# EAGLE board GBARPi (EAGLE 9.6.2)
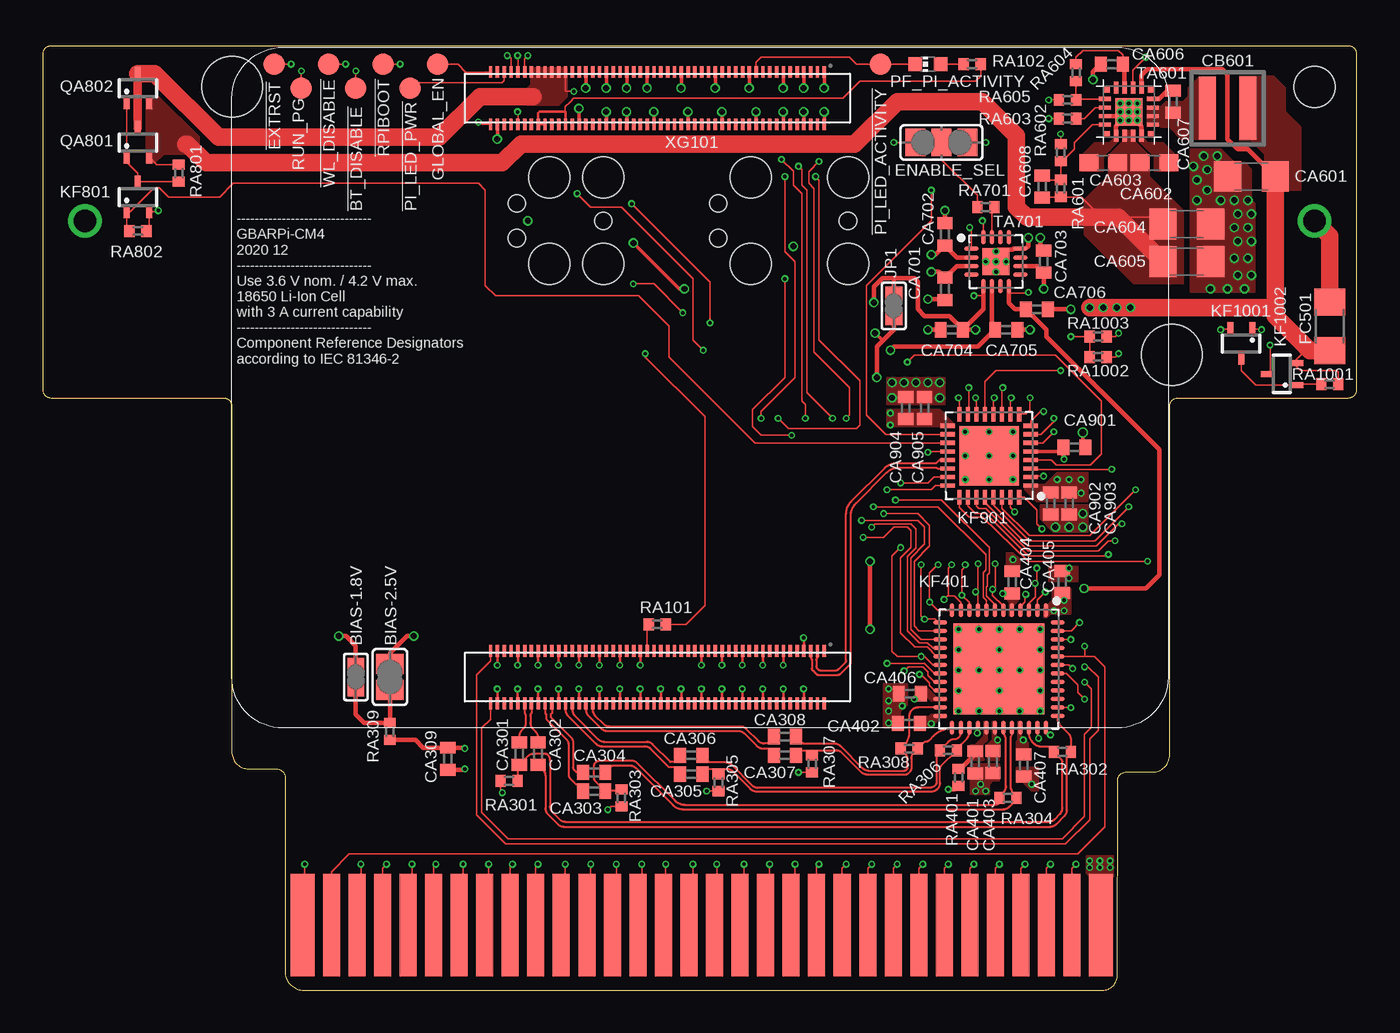
[diagram p3: board, top side]
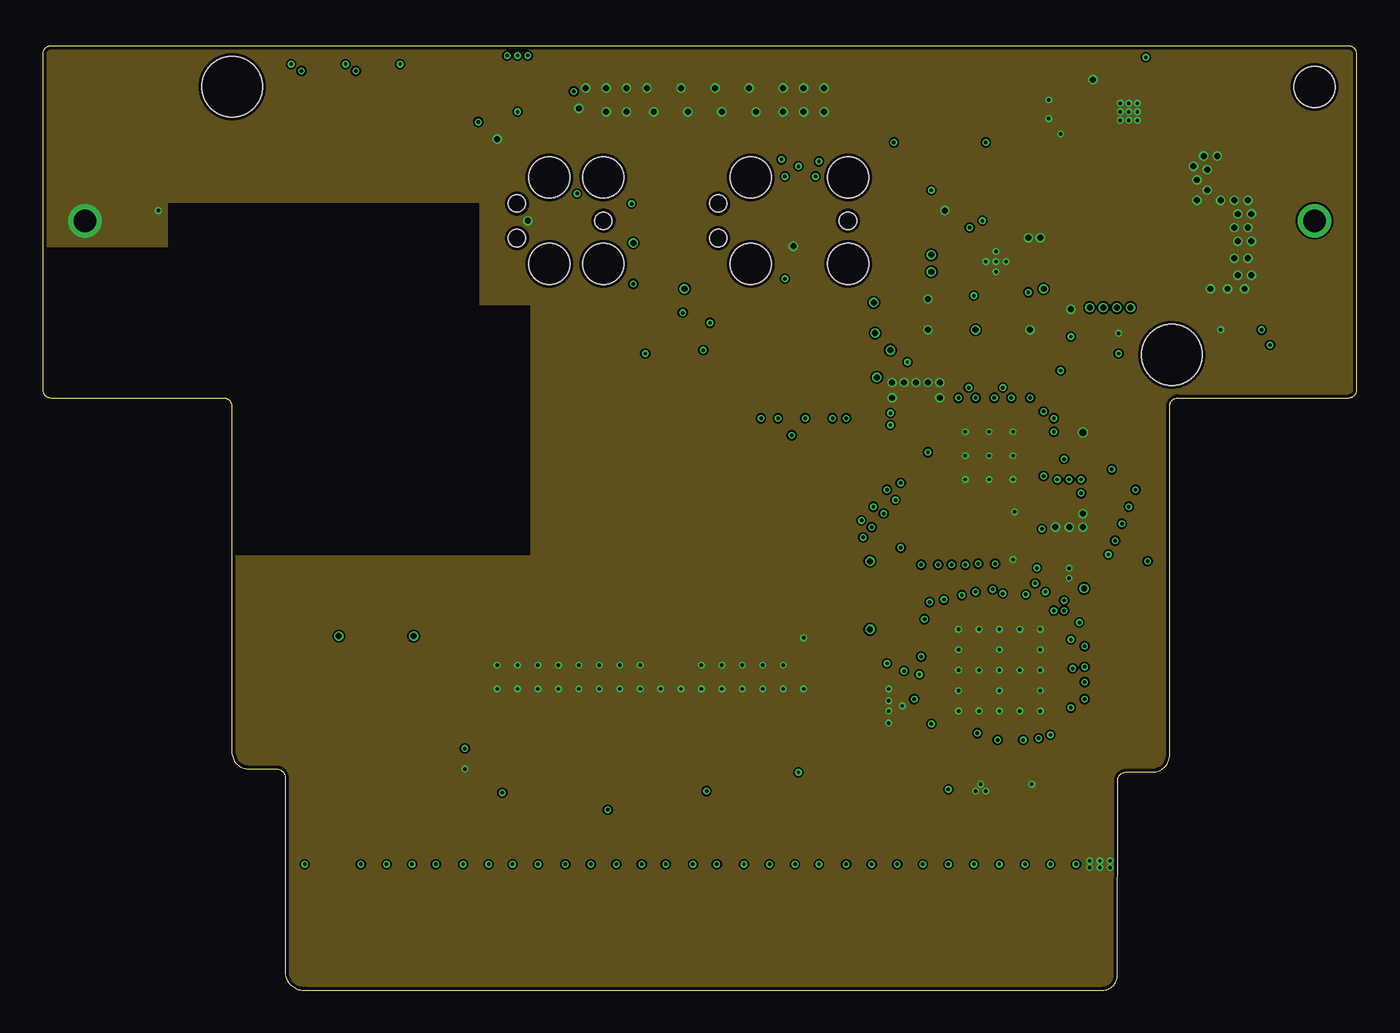
[diagram p4: board, inner layer GND]
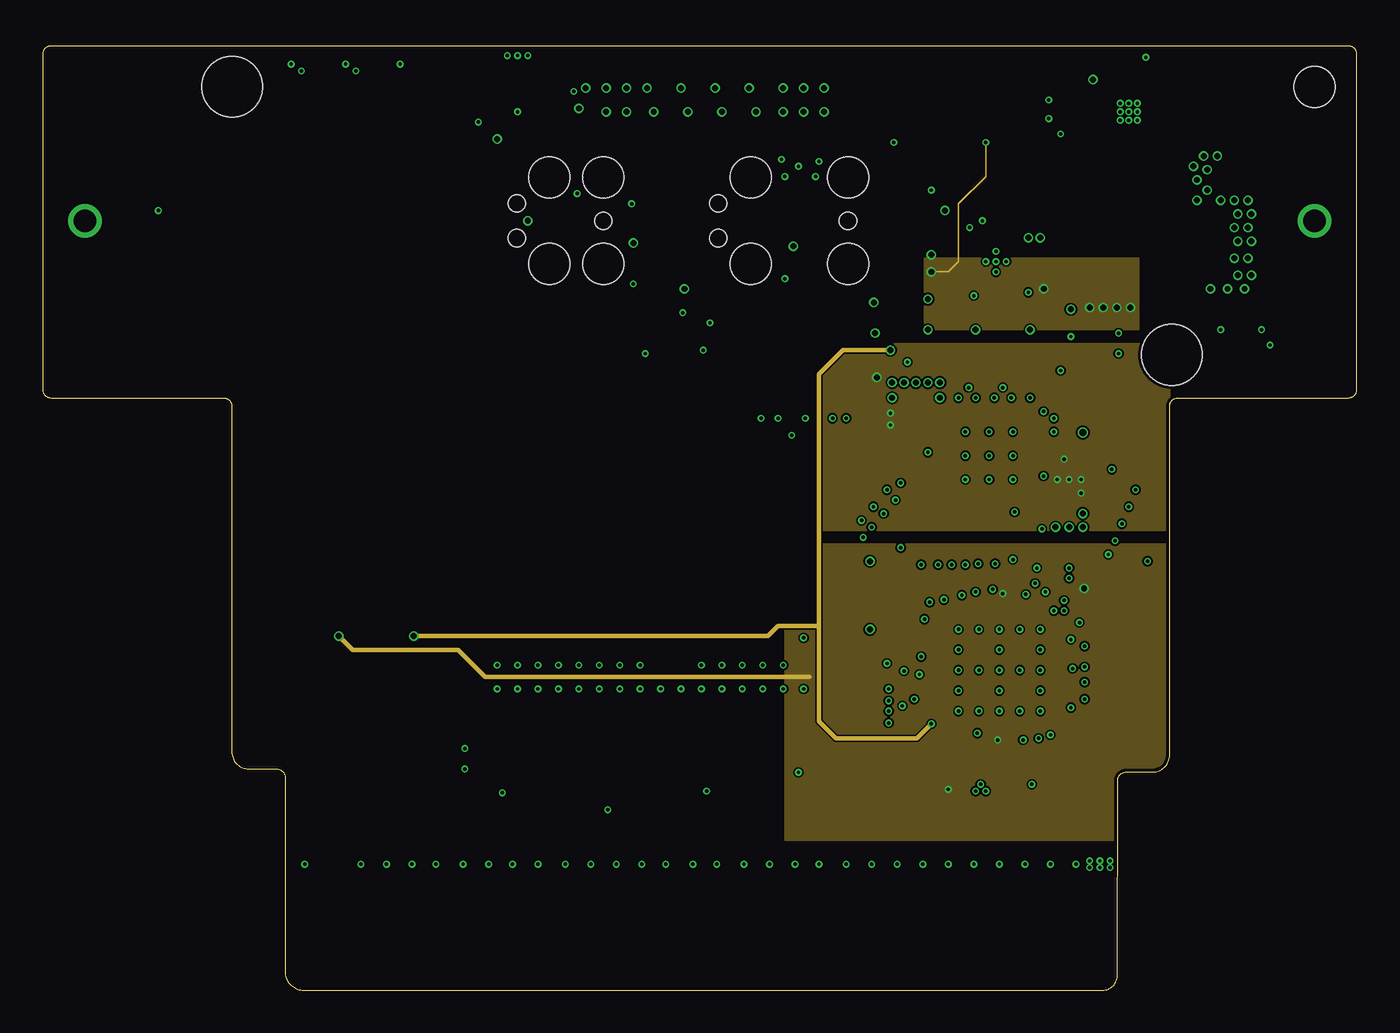
[diagram p5: board, inner layer Route15]
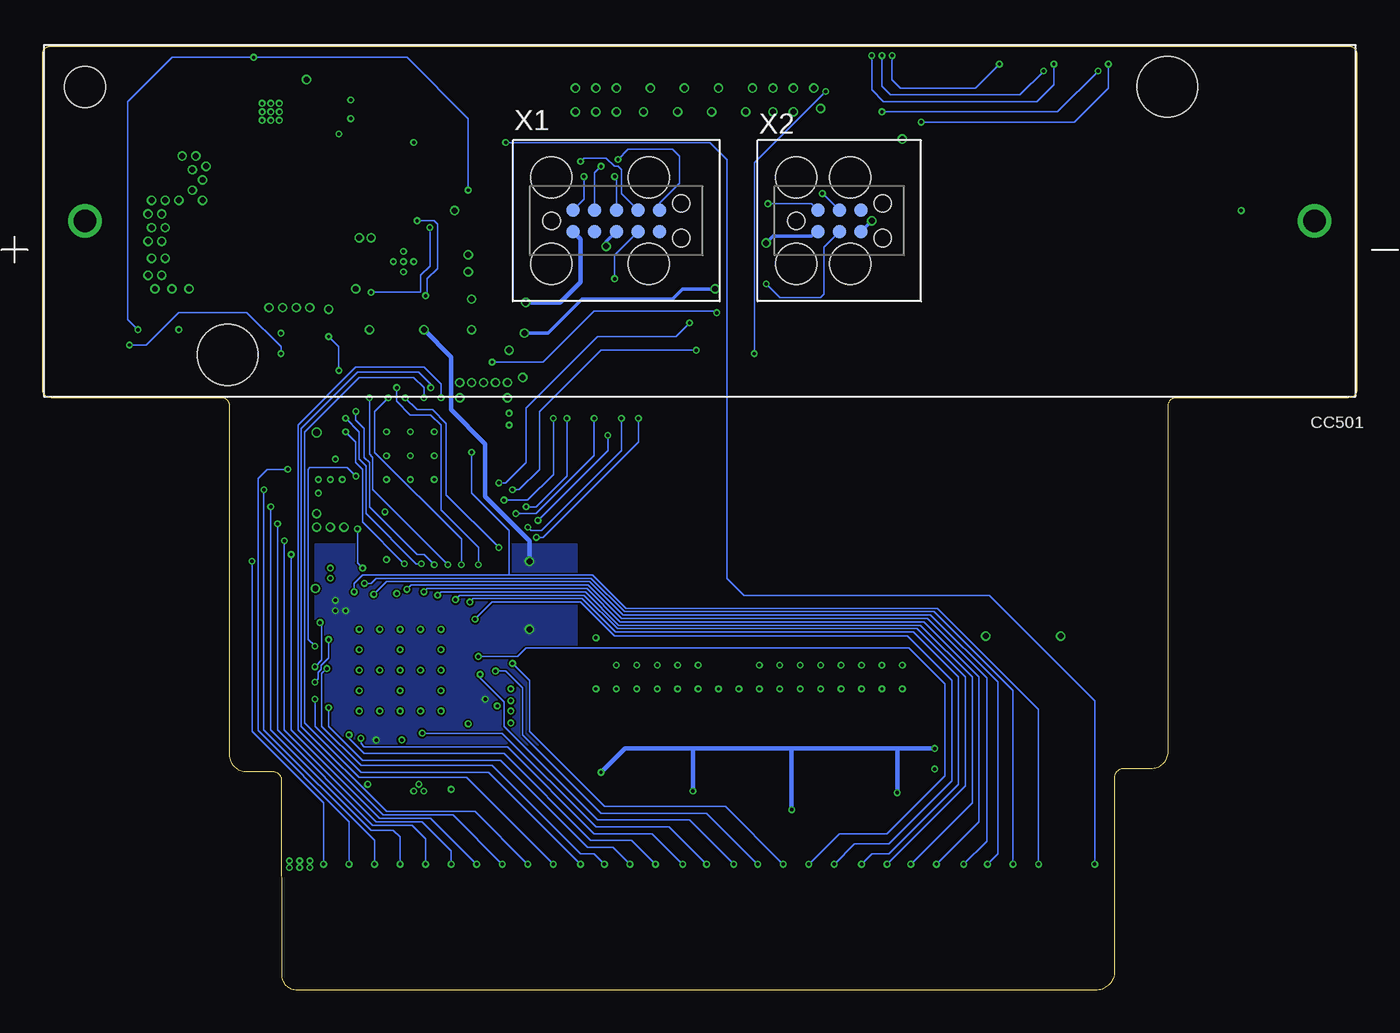
[diagram p6: board, bottom side, seen from below]

Size 77.2 x 55.47 mm. Coordinates in mm from the lower left corner, seen from the top.
Outline: 63.13,1 63.14,12.32 arc-90 63.64,12.82 65.2,12.82 arc90 66.2,13.82 66.2,34.3 arc-90 66.7,34.8 76.7,34.8 arc90 77.2,35.3 77.2,54.97 arc90 76.7,55.47 0.5,55.47 arc90 0,54.97 0,35.3 arc90 0.5,34.8 10.62,34.8 arc-90 11.12,34.3 11.12,14.01 arc90 12.12,13.01 13.75,13.01 arc-90 14.25,12.51 14.25,1 arc90 15.45,0 62.33,0 arc90 63.13,1
Copper layers (1+2*15+16): Top 0.018mm / dielectric 0.36mm / GND 0.035mm / dielectric 0.71mm / Route15 0.035mm / dielectric 0.36mm / Bottom 0.018mm
Design rules "Multi-CB_4L_100um-Tracks_OL35um-IL35um *": minimum track width 0.1mm, minimum drill 0.2mm, track to track 0.1mm, track to pad 0.1mm, pad to pad 0.1mm, via to via 0.1mm, smd to smd 0mil, copper to edge 0.2mm, drill to drill 0.2mm, minimum pad ring 0.125mm, minimum via ring 0.1mm, stop-mask expansion 2mil, vias tented up to drill 0.45mm, thermal gap 0.2mm
Net classes: 1 HDMI: width 0.12 mm, clearance 0.15 mm; 2 USB: width 0.12 mm, clearance 0.15 mm

## Footprints (pad centres in the part's own frame; a part is rotated, then mirrored left to right if it is on the bottom)
B1,27 = smd 1.27 x 1.27: TP 0,0
SJS-NC3 = smd 0.991 x 0.991: 1 -0.635,0; 2 0.635,0
SJ = smd 1.168 x 1.6: 1 -0.762,0; 2 0.762,0
C0402 = smd 0.7 x 0.9: 1 -0.65,0; 2 0.65,0
C1206 = smd 1.6 x 1.8: 1 -1.4,0; 2 1.4,0
C0603 = smd 1.1 x 1: 1 -0.85,0; 2 0.85,0
WE-MAPI_4020 = smd 0.98 x 3.7: 1 -1.185,0; 2 1.185,0
BAT_1043 = drill 1.32: N -36.11,0; P 36.11,0 | hole 3.55: 27.73,7.87; -27.47,-7.87 | hole 2.39: 36.11,-7.87
SJ_2 = smd 1.168 x 1.6: 1 -1.524,0; 2 0,0; 3 1.524,0
R1206 = smd 1.6 x 1.803: 1 -1.422,0; 2 1.422,0
QFN50P700X700X100-49T535N = smd 0.811 x 0.257: 1 -3.451,2.75; 2 -3.451,2.25; 3 -3.451,1.75; 4 -3.451,1.25; 5 -3.451,0.75; 6 -3.451,0.25; 7 -3.451,-0.25; 8 -3.451,-0.75; 9 -3.451,-1.25; 10 -3.451,-1.75; 11 -3.451,-2.25; 12 -3.451,-2.75; 25 3.451,-2.75; 26 3.451,-2.25; 27 3.451,-1.75; 28 3.451,-1.25; 29 3.451,-0.75; 30 3.451,-0.25; 31 3.451,0.25; 32 3.451,0.75; 33 3.451,1.25; 34 3.451,1.75; 35 3.451,2.25; 36 3.451,2.75 | smd 0.257 x 0.811: 13 -2.75,-3.451; 14 -2.25,-3.451; 15 -1.75,-3.451; 16 -1.25,-3.451; 17 -0.75,-3.451; 18 -0.25,-3.451; 19 0.25,-3.451; 20 0.75,-3.451; 21 1.25,-3.451; 22 1.75,-3.451; 23 2.25,-3.451; 24 2.75,-3.451; 37 2.75,3.451; 38 2.25,3.451; 39 1.75,3.451; 40 1.25,3.451; 41 0.75,3.451; 42 0.25,3.451; 43 -0.25,3.451; 44 -0.75,3.451; 45 -1.25,3.451; 46 -1.75,3.451; 47 -2.25,3.451; 48 -2.75,3.451 | smd 5.35 x 5.35: EXP 0,0
SC70-3 = smd 0.35 x 0.8: 1 -0.65,-0.85; 2 0.65,-0.85; 3 0,0.85
QFN50P500X500X60-33T350N = smd 0.862 x 0.254: 1 -2.435,1.75; 2 -2.435,1.25; 3 -2.435,0.75; 4 -2.435,0.25; 5 -2.435,-0.25; 6 -2.435,-0.75; 7 -2.435,-1.25; 8 -2.435,-1.75; 17 2.435,-1.75; 18 2.435,-1.25; 19 2.435,-0.75; 20 2.435,-0.25; 21 2.435,0.25; 22 2.435,0.75; 23 2.435,1.25; 24 2.435,1.75 | smd 0.254 x 0.862: 9 -1.75,-2.435; 10 -1.25,-2.435; 11 -0.75,-2.435; 12 -0.25,-2.435; 13 0.25,-2.435; 14 0.75,-2.435; 15 1.25,-2.435; 16 1.75,-2.435; 25 1.75,2.435; 26 1.25,2.435; 27 0.75,2.435; 28 0.25,2.435; 29 -0.25,2.435; 30 -0.75,2.435; 31 -1.25,2.435; 32 -1.75,2.435 | smd 3.5 x 3.5: 33 0,0
CHIP-LED0603 = smd 0.8 x 0.8: A 0,-0.75; C 0,0.75
R0402 = smd 0.6 x 0.7: 1 -0.5,0; 2 0.5,0
LQFN16 = smd 0.7 x 0.25: 1 -1.405,0.75; 2 -1.405,0.25; 3 -1.405,-0.25; 4 -1.405,-0.75; 9 1.405,-0.75; 10 1.405,-0.25; 11 1.405,0.25; 12 1.405,0.75 | smd 0.25 x 0.7: 5 -0.75,-1.405; 6 -0.25,-1.405; 7 0.25,-1.405; 8 0.75,-1.405; 13 0.75,1.405; 14 0.25,1.405; 15 -0.25,1.405; 16 -0.75,1.405 | smd 0.375 x 0.375: E1 -1.312,1.312; E2 -1.312,-1.312; E3 1.312,-1.312; E4 1.312,1.312 | smd 1.6 x 1.6: TH 0,0
QFN50P300X300X80-17T175N = smd 0.86 x 0.264: 1 -1.435,0.75; 2 -1.435,0.25; 3 -1.435,-0.25; 4 -1.435,-0.75; 9 1.435,-0.75; 10 1.435,-0.25; 11 1.435,0.25; 12 1.435,0.75 | smd 0.264 x 0.86: 5 -0.75,-1.435; 6 -0.25,-1.435; 7 0.25,-1.435; 8 0.75,-1.435; 13 0.75,1.435; 14 0.25,1.435; 15 -0.25,1.435; 16 -0.75,1.435 | smd 1.6 x 1.6: 17 0,0
TC2050 = smd 0.787 x 0.787: 1 -2.54,-0.635; 2 -1.27,-0.635; 3 0,-0.635; 4 1.27,-0.635; 5 2.54,-0.635; 6 2.54,0.635; 7 1.27,0.635; 8 0,0.635; 9 -1.27,0.635; 10 -2.54,0.635 | hole 1: -3.81,0; 3.81,1.016; 3.81,-1.016 | hole 2.4: -3.81,2.54; -3.81,-2.54; 1.905,2.54; 1.905,-2.54
TC2030 = smd 0.787 x 0.787: 1 -1.27,-0.635; 2 -1.27,0.635; 3 0,-0.635; 4 0,0.635; 5 1.27,-0.635; 6 1.27,0.635 | hole 1: -2.54,0; 2.54,1.016; 2.54,-1.016 | hole 2.4: -2.54,2.54; -2.54,-2.54; 0.635,2.54; 0.635,-2.54
CM4 = smd 0.2 x 0.7: 1 34.8,38.54; 2 34.8,35.46; 3 34.4,38.54; 4 34.4,35.46; 5 34,38.54; 6 34,35.46; 7 33.6,38.54; 8 33.6,35.46; 9 33.2,38.54; 10 33.2,35.46; 11 32.8,38.54; 12 32.8,35.46; 13 32.4,38.54; 14 32.4,35.46; 15 32,38.54; 16 32,35.46; 17 31.6,38.54; 18 31.6,35.46; 19 31.2,38.54; 20 31.2,35.46; 21 30.8,38.54; 22 30.8,35.46; 23 30.4,38.54; 24 30.4,35.46; 25 30,38.54; 26 30,35.46; 27 29.6,38.54; 28 29.6,35.46; 29 29.2,38.54; 30 29.2,35.46; 31 28.8,38.54; 32 28.8,35.46; 33 28.4,38.54; 34 28.4,35.46; 35 28,38.54; 36 28,35.46; 37 27.6,38.54; 38 27.6,35.46; 39 27.2,38.54; 40 27.2,35.46; 41 26.8,38.54; 42 26.8,35.46; 43 26.4,38.54; 44 26.4,35.46; 45 26,38.54; 46 26,35.46; 47 25.6,38.54; 48 25.6,35.46; 49 25.2,38.54; 50 25.2,35.46; 51 24.8,38.54; 52 24.8,35.46; 53 24.4,38.54; 54 24.4,35.46; 55 24,38.54; 56 24,35.46; 57 23.6,38.54; 58 23.6,35.46; 59 23.2,38.54; 60 23.2,35.46; 61 22.8,38.54; 62 22.8,35.46; 63 22.4,38.54; 64 22.4,35.46; 65 22,38.54; 66 22,35.46; 67 21.6,38.54; 68 21.6,35.46; 69 21.2,38.54; 70 21.2,35.46; 71 20.8,38.54; 72 20.8,35.46; 73 20.4,38.54; 74 20.4,35.46; 75 20,38.54; 76 20,35.46; 77 19.6,38.54; 78 19.6,35.46; 79 19.2,38.54; 80 19.2,35.46; 81 18.8,38.54; 82 18.8,35.46; 83 18.4,38.54; 84 18.4,35.46; 85 18,38.54; 86 18,35.46; 87 17.6,38.54; 88 17.6,35.46; 89 17.2,38.54; 90 17.2,35.46; 91 16.8,38.54; 92 16.8,35.46; 93 16.4,38.54; 94 16.4,35.46; 95 16,38.54; 96 16,35.46; 97 15.6,38.54; 98 15.6,35.46; 99 15.2,38.54; 100 15.2,35.46; 101 34.8,4.54; 102 34.8,1.46; 103 34.4,4.54; 104 34.4,1.46; 105 34,4.54; 106 34,1.46; 107 33.6,4.54; 108 33.6,1.46; 109 33.2,4.54; 110 33.2,1.46; 111 32.8,4.54; 112 32.8,1.46; 113 32.4,4.54; 114 32.4,1.46; 115 32,4.54; 116 32,1.46; 117 31.6,4.54; 118 31.6,1.46; 119 31.2,4.54; 120 31.2,1.46; 121 30.8,4.54; 122 30.8,1.46; 123 30.4,4.54; 124 30.4,1.46; 125 30,4.54; 126 30,1.46; 127 29.6,4.54; 128 29.6,1.46; 129 29.2,4.54; 130 29.2,1.46; 131 28.8,4.54; 132 28.8,1.46; 133 28.4,4.54; 134 28.4,1.46; 135 28,4.54; 136 28,1.46; 137 27.6,4.54; 138 27.6,1.46; 139 27.2,4.54; 140 27.2,1.46; 141 26.8,4.54; 142 26.8,1.46; 143 26.4,4.54; 144 26.4,1.46; 145 26,4.54; 146 26,1.46; 147 25.6,4.54; 148 25.6,1.46; 149 25.2,4.54; 150 25.2,1.46; 151 24.8,4.54; 152 24.8,1.46; 153 24.4,4.54; 154 24.4,1.46; 155 24,4.54; 156 24,1.46; 157 23.6,4.54; 158 23.6,1.46; 159 23.2,4.54; 160 23.2,1.46; 161 22.8,4.54; 162 22.8,1.46; 163 22.4,4.54; 164 22.4,1.46; 165 22,4.54; 166 22,1.46; 167 21.6,4.54; 168 21.6,1.46; 169 21.2,4.54; 170 21.2,1.46; 171 20.8,4.54; 172 20.8,1.46; 173 20.4,4.54; 174 20.4,1.46; 175 20,4.54; 176 20,1.46; 177 19.6,4.54; 178 19.6,1.46; 179 19.2,4.54; 180 19.2,1.46; 181 18.8,4.54; 182 18.8,1.46; 183 18.4,4.54; 184 18.4,1.46; 185 18,4.54; 186 18,1.46; 187 17.6,4.54; 188 17.6,1.46; 189 17.2,4.54; 190 17.2,1.46; 191 16.8,4.54; 192 16.8,1.46; 193 16.4,4.54; 194 16.4,1.46; 195 16,4.54; 196 16,1.46; 197 15.6,4.54; 198 15.6,1.46; 199 15.2,4.54; 200 15.2,1.46
GBA_CARTRIDGE_CONNECTOR = smd 1.4 x 6: 1 0.7,-3; 32 47.6,-3 | smd 1 x 6: 2 2.4,-3; 3 3.9,-3; 4 5.4,-3; 5 6.9,-3; 6 8.4,-3; 7 9.9,-3; 8 11.4,-3; 9 12.9,-3; 10 14.4,-3; 11 15.9,-3; 12 17.4,-3; 13 18.9,-3; 14 20.4,-3; 15 21.9,-3; 16 23.4,-3; 17 24.9,-3; 18 26.4,-3; 19 27.9,-3; 20 29.4,-3; 21 30.9,-3; 22 32.4,-3; 23 33.9,-3; 24 35.4,-3; 25 36.9,-3; 26 38.4,-3; 27 39.9,-3; 28 41.4,-3; 29 42.9,-3; 30 44.4,-3; 31 45.9,-3

## Placement (x,y rotation side)
!BT_DISABLE  TPB1,27  [B1,27]  18.4,53 90 top
!EXTRST  TPB1,27  [B1,27]  13.6,54.4 90 top
!PI_LED_ACTIVITY  TPB1,27  [B1,27]  49.2,54.4 90 top
!PI_LED_PWR  TPB1,27  [B1,27]  21.6,53 90 top
!RPIBOOT  TPB1,27  [B1,27]  20,54.4 90 top
!WL_DISABLE  TPB1,27  [B1,27]  16.8,54.4 90 top
BIAS-1.8V  [SJS-NC3]  18.4,18.4 270 top
BIAS-2.5V  [SJ]  20.4,18.4 270 top
CA301  [C0402]  28,13.9 90 top
CA302  [C0402]  29.1,13.9 90 top
CA303  [C0402]  32.4,11.7 180 top
CA304  [C0402]  32.4,12.8 180 top
CA305  [C0402]  38.1,12.7 180 top
CA306  [C0402]  38.1,13.8 180 top
CA307  [C0402]  43.6,13.8 180 top
CA308  [C0402]  43.6,14.9 180 top
CA309  [C0402]  23.8,13.6 270 top
CA401  [C0402]  54.78,13.4 270 top
CA402  [C0402]  50.89,15.67 180 top
CA403  [C0402]  55.82,13.41 270 top
CA404  [C0402]  56.95,23.97 90 top
CA405  [C0402]  59.88,23.98 90 top
CA406  [C0402]  50.94,17.43 180 top
CA407  [C0402]  57.62,13.21 270 top
CA601  [C1206]  71,47.8 180 top
CA602  [C0603]  65.3,48.6 0 top
CA603  [C0603]  62.3,48.6 180 top
CA604  [C1206]  67.2,45 0 top
CA605  [C1206]  67.2,42.8 0 top
CA606  [C0402]  62.8,54.4 180 top
CA607  [C0402]  66.4,52.2 90 top
CA608  [C0402]  58.7,47.2 90 top
CA701  [C0402]  53,41.2 270 top
CA702  [C0402]  53,44.4 90 top
CA703  [C0402]  58.8,42.8 90 top
CA704  [C0402]  53.4,38.8 180 top
CA705  [C0402]  56.6,38.8 0 top
CA706  [C0402]  58.4,40 0 top
CA901  [C0402]  60.6,31.9 0 top
CA902  [C0402]  59.2,28.6 270 top
CA903  [C0402]  60.3,28.6 270 top
CA904  [C0402]  50.7,34.2 90 top
CA905  [C0402]  51.8,34.2 90 top
CB601  5.6uH  [WE-MAPI_4020]  69.6,51.8 180 top
CC501  1043  [BAT_1043]  38.6,45.2 180 bottom
ENABLE_SEL  [SJ_2]  52.8,49.8 0 top
FC501  [R1206]  75.6,39 270 top
GLOBAL_EN  TPB1,27  [B1,27]  23.2,54.4 90 top
JP1  [SJS-NC3]  50,40.2 270 top
KF401  ICE40UP5KSG48  [QFN50P700X700X100-49T535N]  56.17,18.87 270 top
KF801  BSS138PW  [SC70-3]  5.6,46.6 0 top
KF901  STM32F042  [QFN50P500X500X60-33T350N]  55.6,31.4 180 top
KF1001  BSS138PW  [SC70-3]  70.4,38 180 top
KF1002  NTS2101PT1G  [SC70-3]  72.8,36.2 90 top
PF_PI_ACTIVITY  [CHIP-LED0603]  52,54.4 90 top
QA801  NTS2101PT1G  [SC70-3]  5.6,49.8 0 top
QA802  NTS2101PT1G  [SC70-3]  5.6,53 0 top
RA101  1k  [R0402]  36.1,21.5 180 top
RA102  10k  [R0402]  54.6,54.4 0 top
RA301  10k  [R0402]  27.4,12.3 180 top
RA302  100  [R0402]  59.9,14 180 top
RA303  [R0402]  34,11.3 270 top
RA304  [R0402]  56.7,11.3 180 top
RA305  [R0402]  39.7,12.2 270 top
RA306  [R0402]  53.2,14.1 0 top
RA307  [R0402]  45.2,13.3 270 top
RA308  [R0402]  50.9,14.2 0 top
RA309  100  [R0402]  20.4,15.2 270 top
RA401  [R0402]  53.8,12.5 270 top
RA601  [R0402]  59.8,47.1 270 top
RA602  [R0402]  59.8,49.2 270 top
RA603  [R0402]  60.2,51.2 0 top
RA604  [R0402]  60.7,53.9 90 top
RA605  [R0402]  60.2,52.3 0 top
RA701  10k  [R0402]  55.4,46 0 top
RA801  10k  [R0402]  8,48 90 top
RA802  10k  [R0402]  5.6,44.6 180 top
RA1001  10k  [R0402]  75.6,35.6 0 top
RA1002  10k  [R0402]  62,37.2 0 top
RA1003  10k  [R0402]  62,38.4 180 top
RUN_PG  TPB1,27  [B1,27]  15.2,53 90 top
TA601  LT8336  [LQFN16]  63.8,51.6 0 top
TA701  ADP322ACPZ-145-R7  [QFN50P300X300X80-17T175N]  56,42.8 0 top
X1  TC2050  [TC2050]  43.5,45.2 0 bottom
X2  TC2030  [TC2030]  30.4,45.2 0 bottom
XG101  CM4  [CM4]  11.12,15.4 0 top
XG201  GBA_CARTRIDGE_CONNECTOR  [GBA_CARTRIDGE_CONNECTOR]  14.57,6.83 0 top

## Tracks (layer width: path | path; a pad name or v marks a point on that pad's centre or on a via)
!BT_DISABLE  (via drill 0.2)
  Top 0.1: !BT_DISABLE.TP v18.4,54 | v27.9,54.9 27.91,54.89 XG101.91
  Bottom 0.1: v18.4,54 19.8,52.6 27.4,52.6 27.9,53.1 v27.9,54.9
!EXTRST  (via drill 0.2)
  Top 0.1: !EXTRST.TP v14.6,54.4 | v25.6,51 25.74,50.86 XG101.100
  Bottom 0.1: v14.6,54.4 14.6,53 16.6,51 v25.6,51
!GBA_CS1  (via drill 0.2)
  Top 0.1: KF401.4 57.42,22.53 57.7,22.8 57.7,23.2 v57.75,23.26 | XG201.5 21.7,4.06 v21.7,7.4
  Bottom 0.1: v57.75,23.26 57,24 45.07,24 43.11,22.05 25.04,22.05 21.1,18.1 21.1,8 v21.7,7.4
!GBA_CS2  (via drill 0.2)
  Top 0.1: XG201.30 58.97,7.17 v59.2,7.4 | v62.8,30.6 58.09,30.6 KF901.3
  Bottom 0.1: v59.2,7.4 59.2,9.9 64.55,15.25 64.55,30.05 64,30.6 v62.8,30.6
!GBA_RD  (via drill 0.2)
  Top 0.1: KF401.3 57.92,22.73 58.3,23.1 v58.3,23.9 58.4,24 v58.4,24.8 | XG201.4 19.97,7.17 v20.2,7.4 | KF901.32 57.63,28.97 58.4,28.2 58.4,27.4 v58.7,27.1
  Bottom 0.1: v20.2,7.4 20.2,17.6 23.7,21.1 23.8,21.2 24.84,22.25 43.03,22.25 44.99,24.2 57.6,24.2 57.9,23.9 v58.3,23.9 | v58.7,27.1 58.7,25.1 v58.4,24.8
!GBA_WR  (via drill 0.2)
  Top 0.1: KF401.2 58.42,22.93 v58.9,23.4 | v18.7,7.4 18.7,4.06 XG201.3 | KF901.20 52.05,31.65 v52,31.6
  Bottom 0.1: v58.9,23.4 58.9,23.9 58.4,24.4 49.8,24.4 | v18.7,7.4 18.7,16.5 24.64,22.45 42.94,22.45 44.9,24.4 49.8,24.4 | v52,31.6 52,29.2 49.8,27 49.8,24.4
!PI_LED_ACTIVITY
  Top 0.1: XG101.21 41.91,54.52 42.2,54.8 47.4,54.8 47.8,54.4 !PI_LED_ACTIVITY.TP PF_PI_ACTIVITY.C
!PI_LED_PWR
  Top 0.1: !PI_LED_PWR.TP 21.9,53.3 27,53.3 27.12,53.42 XG101.95
!RPIBOOT  (via drill 0.2)
  Top 0.1: !RPIBOOT.TP v21,54.4 | v27.3,54.9 27.35,54.9 27.52,54.74 XG101.93
  Bottom 0.1: v21,54.4 22.4,53 26.8,53 27.3,53.5 v27.3,54.9
!STM_RESET  (via drill 0.2)
  Top 0.1: KF901.4 59.25,31.15 59.55,30.85 61.55,30.85 62.2,31.5 62.2,34.6 59.5,37.3 51.2,37.3 v50.8,36.9 | v37.6,39.8 35.9,41.5 v34.7,41.5
  Bottom 0.1: X2.3 31.3,43.67 31.3,40.9 31.5,40.7 33.9,40.7 v34.7,41.5 | v50.8,36.9 47.8,36.9 44.8,39.9 37.7,39.9 v37.6,39.8
!WL_DISABLE  (via drill 0.2)
  Top 0.1: !WL_DISABLE.TP v17.8,54.4 | v28.5,54.9 28.31,54.72 XG101.89
  Bottom 0.1: v17.8,54.4 17.8,53.2 18.8,52.2 27.8,52.2 28.5,52.9 v28.5,54.9
+3V3  (via drill 0.2, 0.35)
  Top 0.2: v34.7,43.9 37.4,41.2 v37.7,41.2 | v48.9,38.6 49.35,38.15
  Top 0.203: KF901.5 59.7,31.65 CA901.1
  Top 0.254: v60,31.2 59.95,31.25 CA901.1 | JP1.2 50,38.8 49.35,38.15 49,37.8 v49,36
  Bottom 0.2: X2.1 31.77,44.57 32.04,44.3 34.3,44.3 v34.7,43.9 | v37.7,41.2 39.6,41.2 40.2,40.6 45.5,40.6 47.5,38.6 v48.9,38.6
  other vias: 49.8,33.9 49.8,33.2 59.6,30 60.3,30 61,30 61,29.2
  pour Top (no thermals): 49.6,34.1 52.7,34.1 53.5,33.3 53.5,33.1 49.6,33.1
  pour Top (no thermals): 57.7,29.7 58.9,29.7 59.5,30.3 59.6,30.4 60,30.4 61.4,30.4 61.4,28.7 58.4,28.7 57.7,29.4
  pour Route15 (no thermals): 45.6,38 66.2,38 66.2,27 45.6,27
+5V
  Top 0.1: CA608.1 58.75,46.6 RA601.2 61,46.6 62.2,45.4 65.4,45.4 CA604.1 | RA801.2 6.7,48.5 QA801.2
  Top 1.016: CA605.1 63.2,45.4 57.8,45.4 57.2,46 57.2,50.2 55.2,52.2 50.2,52.2 47.7,49.7 28.1,49.7 27,48.6 9.6,48.6 8.5,49.7 8.4,49.7
  pour Top (no thermals): 63.5,50.5 64.1,50.5 64.1,49.9 65,49 65,48.1 62.6,48.1 62.6,49 63.5,49.9
  pour Top (no thermals): 65,48.2 65,47.8 67,45.8 67,41.5 64.1,41.5 61.2,44.4 61.2,46.4 62.6,47.8 62.6,48.2
  pour Top (no thermals): 6.1,48.6 6.1,52.5 6.8,52.5 9.2,50.1 9.2,49.1 7.1,49.1 6.6,48.6
+5V_PI  (via drill 0.2)
  Top 0.1: RA101.1 37.8,21.5 38.9,22.6 38.9,33.7 35.4,37.2 v35.4,37.4 | v31.2,52.8 30.72,52.8 XG101.77
  Top 0.508: QA802.3 QA801.3
  Top 1.016: QA802.3 6.6,53.85 10.35,50.1 23.3,50.1 25.7,52.5 28.8,52.5
  Bottom 0.1: v31.2,52.8 35.4,48.6 v35.4,37.4
  pour Top (no thermals): 28.7,54.2 28.7,53.2 28.4,52.9 28.4,52 30.3,52 30.8,52.5 30.8,53.3 30.8,54.2
+5V_PI_EN
  Top 0.1: RA802.2 4.95,44.75 KF801.1 5.15,45.75 6.55,47.15 6.85,47.15 7.4,46.6 10.4,46.6 11.2,47.4 25.6,47.4 26,47 26,41.4 26.6,40.8 35,40.8 36.8,39 36.8,37.2 41.85,32.15 KF901.19
BAT  (via drill 0.2, 0.35)
  Top 0.1: ENABLE_SEL.3 v55.4,49.8 | RA1001.2 76.1,36.3 76,36.4 73.9,36.4 73.65,36.65 KF1002.2 73.65,37.05 74.18,37.58 FC501.2
  Top 0.254: TA601.13 64.55,53.75 64.9,54.1 69.3,54.1 69.6,53.8 69.6,50 70.2,49.4 70.8,49.4 CA601.1 | TA701.2 53.7,43.05 CA702.1 52.45,43.2 v52.2,43.2 | TA701.3 53.7,42.55 CA701.1 52.65,42.2 v52.2,42.2 | TA701.10 58.4,42.55 CA703.1 v58.8,41.2
  Top 1.016: CA601.1 72.4,40.1 | 72.4,40.1 72.4,39.6 74.42,37.58 FC501.2 | 72.4,40.1 v61.5,40.1
  Route15 0.1: v55.4,49.8 55.4,47.8 53.8,46.2 53.8,42.8 53.2,42.2 v52.2,42.2
  other vias: 62.3,40.1 63.1,40.1 63.9,40.1
  pour Top (no thermals): 70.3,53.7 72.3,53.7 73,53 73,51.6 73.9,50.7 73.9,47 71.8,47 71.8,49.1 71,49.9 70.3,49.9
  pour Route15 (no thermals): 51.8,43 64.4,43 64.4,38.8 51.8,38.8
BAT_UNFUSED
  Top 1.016: CC501.P 75.6,44.31 FC501.1
BATT_VOLTAGE  (via drill 0.2)
  Top 0.1: RA1002.1 RA1003.2 v60.4,38.4 | KF901.13 55.35,35.75 56,36.4 v59.8,36.4
  Bottom 0.1: v59.8,36.4 59.8,37.8 v60.4,38.4
CM4_3.3V_OUT
  Top 0.1: RA102.2 55.1,53.7 54.8,53.4 48,53.4 47,52.4 31.5,52.4 31.2,52.4 31,52.2 30.7,51.9 30.7,51.6
  Top 0.152: XG101.78 30.72,51.59 30.7,51.6 29.2,51.6 29.12,51.52 XG101.86 XG101.84
DCDC_EN  (via drill 0.2)
  Top 0.1: KF901.18 49.55,32.65 48.4,33.8 48.4,41.4 52.2,45.2 v52.2,47 | v64.8,54.8 64.05,54.05 TA601.14 | KF1001.1 71.55,38.85 v71.6,38.8
  Bottom 0.1: v52.2,47 52.2,51.2 55.8,54.8 v64.8,54.8 69.6,54.8 72.2,52.2 72.2,39.4 v71.6,38.8
DIFF_BIAS  (via drill 0.2)
  Top 0.1: RA307.2 v44.4,12.8 | RA305.2 v39,11.7 | RA303.2 33.4,10.8 v33.2,10.6 | RA301.2 26.9,11.7 v27,11.6
  Top 0.254: v24.8,14.2 24.75,14.25 CA309.1 22.35,14.25 21.9,14.7 RA309.2
  Bottom 0.254: v27,11.6 27,14.2 | 27,14.2 33.2,14.2 | 33.2,14.2 39,14.2 | 39,14.2 43,14.2 v44.4,12.8 | v39,11.7 39,14.2 | v33.2,10.6 33.2,14.2 | 27,14.2 v24.8,14.2
GBA_ADDRESS_DATA0  (via drill 0.2)
  Top 0.1: KF401.6 56.42,22.58 55.8,23.2 v55.8,23.55 55.95,23.71 v55.95,25.06 | v23.1,7.4 22.97,7.27 XG201.6 | KF901.6 58.75,32.15 v59.4,32.8
  Bottom 0.1: v55.8,23.55 55.55,23.8 45.15,23.8 43.19,21.85 25.22,21.85 21.74,18.36 21.74,8.76 v23.1,7.4 | v59.4,32.8 58.8,32.2 58.8,31 58.4,30.6 58.4,27.5 v55.95,25.06
GBA_ADDRESS_DATA1  (via drill 0.2)
  Top 0.1: KF401.9 54.92,23.28 | 54.92,23.28 v54.8,23.4 | v24.7,7.4 24.7,4.06 XG201.7 | KF901.7 58.65,32.65 59.4,33.4 v59.4,33.6 | v54.95,25.06 54.92,25.03 54.92,23.28
  Bottom 0.1: v54.8,23.4 54.6,23.6 45.23,23.6 43.28,21.65 25.44,21.65 22.2,18.4 22.2,9.9 v24.7,7.4 | v59.4,33.6 58.6,32.8 58.6,31.2 58.2,30.8 58.2,28 55.25,25.06 v54.95,25.06
GBA_ADDRESS_DATA2  (via drill 0.2)
  Top 0.1: KF401.10 54.42,22.78 v54,23.2 54,24.7 54.2,24.9 v54.2,25 | v26.2,7.4 26.2,4.06 XG201.8 | KF901.8 58.03,33.44 58.6,34 v58.8,34
  Bottom 0.1: v54,23.2 53.8,23.4 45.32,23.4 43.36,21.45 25.64,21.45 22.6,18.4 22.6,11 v26.2,7.4 | v58.8,34 58.8,33.5 58.3,33 58.3,31.3 58,31 58,28.4 55.2,25.6 54.8,25.6 v54.2,25
GBA_ADDRESS_DATA3  (via drill 0.2)
  Top 0.1: KF401.11 53.92,22.77 53.55,23.15 53.2,23.15 | 53.2,23.15 53.15,23.15 v52.95,22.95 | v27.6,7.4 27.47,7.27 XG201.9 | KF901.9 57.75,33.84 58,34.09 v58,34.8 | v53.4,25 53.2,24.8 53.2,23.15
  Bottom 0.1: v52.95,22.95 52.69,23.2 45.4,23.2 43.44,21.25 25.84,21.25 23,18.4 23,12 v27.6,7.4 | v58,34.8 58,31.5 57.8,31.3 57.8,29.4 v53.4,25
GBA_ADDRESS_DATA4  (via drill 0.2)
  Top 0.1: KF401.12 52.59,22.32 v52.1,22.8 52.1,24.5 v52.6,25 | v29.1,7.4 28.97,7.27 XG201.10 | KF901.10 56.85,34.75 v56.9,34.8
  Bottom 0.1: v52.1,22.8 51.9,23 45.52,23 43.56,21.05 26.04,21.05 23.4,18.4 23.4,12.1 27.5,8 28.5,8 v29.1,7.4 | v56.9,34.8 57.7,34 57.7,31.6 52.6,26.5 v52.6,25
GBA_ADDRESS_DATA5  (via drill 0.2)
  Top 0.1: KF401.13 52.59,21.62 52.4,21.8 v51.8,21.8 51.6,22 v51.6,25 | v30.7,7.4 30.7,4.06 XG201.11 | KF901.11 56.35,35.35 v56.4,35.4
  Bottom 0.1: v51.8,21.8 50.8,22.8 45.6,22.8 43.6,20.8 26.4,20.8 23.8,18.2 23.8,12.3 27.5,8.6 29.5,8.6 v30.7,7.4 | v56.4,35.4 56.4,34.6 55.6,33.8 54.4,33.8 53.8,33.2 53.8,28.2 51.6,26 v51.6,25
GBA_ADDRESS_DATA6  (via drill 0.2)
  Top 0.1: KF401.18 52.3,19.12 51.8,19.62 51.61,19.62 v51.6,19.6 50.2,19.6 49.9,19.9 49.9,25.5 v50.4,26 | v32.2,7.4 32.2,4.06 XG201.12 | KF901.12 55.85,34.75 v55.9,34.8
  Bottom 0.1: v51.6,19.6 49.3,19.6 48.8,20.1 26.3,20.1 24.2,18 24.2,12.6 27.6,9.2 30.4,9.2 v32.2,7.4 | v55.9,34.8 55.2,34.1 54.3,34.1 53.5,33.3 53.5,29.1 v50.4,26
GBA_ADDRESS_DATA7  (via drill 0.2)
  Top 0.1: KF401.19 52.39,18.62 51.8,19.2 v49.6,19.2 | v33.7,7.4 33.7,4.06 XG201.13
  Bottom 0.1: v49.6,19.2 48.6,18.2 48.6,15.2 44.2,10.8 37.1,10.8 v33.7,7.4
GBA_ADDRESS_DATA8  (via drill 0.2)
  Top 0.1: KF401.20 52.39,18.12 52,18.5 52,18.7 51.7,19 50.85,19 v50.6,18.75 | v35.2,7.4 35.2,4.06 XG201.14
  Bottom 0.1: v50.6,18.75 50,18.75 49,17.75 49,15 44.4,10.4 38.2,10.4 v35.2,7.4
GBA_ADDRESS_DATA9  (via drill 0.2)
  Top 0.1: KF401.21 52.39,17.62 52.1,17.9 52.1,18.05 51.6,18.55 v51.5,18.55 | v36.6,7.4 36.6,3.96 XG201.15
  Bottom 0.1: v51.5,18.55 51.5,18.35 50.1,16.95 50.1,15.5 44.6,10 39.2,10 v36.6,7.4
GBA_ADDRESS_DATA10  (via drill 0.2)
  Top 0.1: KF401.28 54.92,15.13 v54.9,15.1 | v38.2,7.4 38.2,4.06 XG201.16
  Bottom 0.1: v54.9,15.1 50.2,15.1 44.7,9.6 40.4,9.6 v38.2,7.4
GBA_ADDRESS_DATA11  (via drill 0.2)
  Top 0.1: KF401.35 58.42,14.88 v58.5,14.8 | v39.6,7.4 39.6,3.96 XG201.17
  Bottom 0.1: v58.5,14.8 58.5,14.5 58.3,14.3 49.9,14.3 44.8,9.2 41.4,9.2 v39.6,7.4
GBA_ADDRESS_DATA12  (via drill 0.2)
  Top 0.1: KF401.36 59,15.39 59,15.2 v59.2,15 | v41.2,7.4 41.2,4.06 XG201.18
  Bottom 0.1: v59.2,15 59.2,14.8 58.3,13.9 50.1,13.9 45,8.8 42.6,8.8 v41.2,7.4
GBA_ADDRESS_DATA13  (via drill 0.2)
  Top 0.1: v60.4,16.6 60.39,16.62 KF401.38 | v42.7,7.4 42.7,4.06 XG201.19
  Bottom 0.1: v60.4,16.6 60.4,15.5 58.4,13.5 50.3,13.5 45.2,8.4 43.7,8.4 v42.7,7.4
GBA_ADDRESS_DATA14  (via drill 0.2)
  Top 0.1: v44.2,7.4 44.2,4.06 XG201.20 | KF401.43 60.29,19.12 v60.5,18.9
  Bottom 0.1: v60.5,18.9 60.8,18.6 60.8,15.5 58.5,13.2 50.8,13.2 45.6,8 44.8,8 v44.2,7.4
GBA_ADDRESS_DATA15  (via drill 0.2)
  Top 0.1: KF401.42 60.13,18.62 60.8,17.94 60.8,17.5 v61.2,17.1 | v45.6,7.4 45.47,7.27 XG201.21
  Bottom 0.1: v61.2,17.1 61.2,15.5 58.5,12.8 51,12.8 v45.6,7.4
GBA_ADDRESS_DATA16  (via drill 0.2)
  Top 0.1: XG201.22 46.97,7.17 v47.2,7.4 | v54.8,34.8 54.85,34.75 KF901.14
  Bottom 0.1: v47.2,7.4 52.3,12.5 58.6,12.5 61.8,15.7 61.8,32.8 58.6,36 55.4,36 54.8,35.4 v54.8,34.8
GBA_ADDRESS_DATA17  (via drill 0.2)
  Top 0.1: XG201.23 48.47,7.17 v48.7,7.4 | v54.4,35.4 54.4,33.89 KF901.15
  Bottom 0.1: v48.7,7.4 51.8,10.5 57,10.5 62,15.5 62,33 58.7,36.3 55.1,36.3 54.4,35.6 v54.4,35.4
GBA_ADDRESS_DATA18  (via drill 0.2)
  Top 0.1: XG201.24 49.97,7.17 v50.2,7.4 | v53.8,34.8 53.85,34.75 KF901.16
  Bottom 0.1: v50.2,7.4 53.1,10.3 57.2,10.3 62.2,15.3 62.2,33.2 58.8,36.6 54.8,36.6 53.8,35.6 v53.8,34.8
GBA_ADDRESS_DATA19  (via drill 0.2)
  Top 0.1: XG201.25 51.47,7.17 v51.7,7.4 | v62.6,25.6 62.5,25.5 57.9,25.5 55.4,28 54.8,28 54.35,28.45 KF901.26
  Bottom 0.1: v51.7,7.4 54.4,10.1 57.4,10.1 62.6,15.3 v62.6,25.6
GBA_ADDRESS_DATA20  (via drill 0.2)
  Top 0.1: XG201.26 52.97,7.17 v53.2,7.4 | v63,26.4 62.6,26.4 62,25.8 57.9,25.8 55.4,28.3 55,28.3 54.85,28.45 KF901.27
  Bottom 0.1: v53.2,7.4 53.2,8.2 54.9,9.9 57.6,9.9 63,15.3 v63,26.4
GBA_ADDRESS_DATA21  (via drill 0.2)
  Top 0.1: XG201.27 54.47,7.17 v54.7,7.4 | v63.4,27.4 63.2,27.4 61.9,26.1 57.9,26.1 55.35,28.65 KF901.28
  Bottom 0.1: v54.7,7.4 54.7,8.9 55.5,9.7 57.8,9.7 63.4,15.3 v63.4,27.4
GBA_ADDRESS_DATA22  (via drill 0.2)
  Top 0.1: XG201.28 55.97,7.17 v56.2,7.4 | v63.8,28.4 61.8,26.4 57.95,26.4 55.85,28.5 KF901.29
  Bottom 0.1: v56.2,7.4 56.2,9 56.6,9.4 57.9,9.4 63.8,15.3 v63.8,28.4
GBA_ADDRESS_DATA23  (via drill 0.2)
  Top 0.1: XG201.29 57.47,7.17 v57.7,7.4 | v64.2,29.4 61.5,26.7 57.95,26.7 56.35,28.3 KF901.30
  Bottom 0.1: v57.7,7.4 57.7,8.8 64.2,15.3 v64.2,29.4
GBA_CLK  (via drill 0.2)
  Top 0.1: v61.2,20.22 61.23,20.19 61.23,19.62 | 61.23,19.62 61.2,19.62 KF401.44 | KF901.2 58.09,30.2 v58.8,30.2 | XG201.2 16.97,6.97 18,8 60.8,8 62.4,9.6 62.4,19 61.79,19.62 61.23,19.62
  Bottom 0.1: v58.8,30.2 59.3,30.7 61.5,30.7 61.6,30.6 61.6,20.62 v61.2,20.22
GBA_IRQ  (via drill 0.2)
  Top 0.1: XG201.31 60.47,7.17 v60.7,7.4 | v64.9,25.2 57.9,25.2 55.2,27.8 54.4,27.8 53.85,28.35 KF901.25
  Bottom 0.1: v60.7,7.4 60.7,11 64.9,15.2 v64.9,25.2
GBA_VCC  (via drill 0.2)
  Top 0.1: XG201.1 15.4,3.96 v15.4,7.4 | v50,49.8 ENABLE_SEL.1
  Bottom 0.1: v50,49.8 38,49.8 37,48.8 37,24.2 36,23.2 21.6,23.2 15.4,17 v15.4,7.4
GLOBAL_EN
  Top 0.1: GLOBAL_EN.TP 24.4,54.4 24.86,53.94 XG101.99
GND  (via drill 0.2, 0.35, 0.4)
  Top 0.1: KF901.31 56.85,28.35 v57.1,28.1 | RA605.1 v59.1,52.3 | RA603.1 v59.1,51.2 | RA602.1 v59.8,50.3 | RA802.1 6.25,44.75 KF801.2 6.75,45.75 v6.8,45.8 | KF401.EXP 56.17,18.83 v56.2,18.8 | KF1001.2 69.25,38.85 v69.2,38.8 | RA1003.1 63,38.4 v63.2,38.6
  Top 0.15: XG101.198 26.72,17.69 v26.7,17.7 | XG101.192 27.9,16.88 v27.9,17.7 | XG101.186 29.12,17.69 v29.1,17.7 | XG101.180 30.31,17.69 v30.3,17.7 | XG101.174 31.5,16.88 v31.5,17.7 | XG101.168 32.72,17.69 v32.7,17.7 | XG101.162 33.91,17.69 v33.9,17.7 | XG101.156 35.12,17.69 v35.1,17.7 | XG101.150 36.31,17.69 v36.3,17.7 | XG101.144 37.52,17.69 v37.5,17.7 | XG101.138 38.71,17.69 v38.7,17.7 | XG101.132 39.9,16.88 v39.9,17.7 | XG101.126 41.12,17.69 v41.1,17.7 | XG101.120 42.3,16.88 v42.3,17.7 | XG101.114 43.52,17.69 v43.5,17.7 | XG101.108 44.71,17.69 v44.7,17.7 | XG101.107 44.71,20.69 v44.7,20.7 | XG101.113 43.52,19.12 v43.5,19.1 | XG101.119 42.31,19.12 v42.3,19.1 | XG101.125 41.12,19.12 v41.1,19.1 | XG101.131 39.91,19.12 v39.9,19.1 | XG101.137 38.71,19.12 v38.7,19.1 | XG101.155 35.12,19.12 v35.1,19.1 | XG101.161 33.91,19.12 v33.9,19.1 | XG101.167 32.7,19.93 v32.7,19.1 | XG101.173 31.52,19.12 v31.5,19.1 | XG101.179 30.31,19.12 v30.3,19.1 | XG101.185 29.12,19.12 v29.1,19.1 | XG101.191 27.91,19.12 v27.9,19.1 | XG101.197 26.72,19.12 v26.7,19.1
  Top 0.2: XG101.65 33.12,53.02 v33.1,53 | XG101.71 31.91,53.02 v31.9,53 | XG101.59 34.31,53.02 v34.3,53 | XG101.53 35.52,53.02 v35.5,53 | XG101.43 37.52,53.02 v37.5,53 | XG101.33 39.52,53.02 v39.5,53 | XG101.23 41.52,53.02 v41.5,53 | XG101.13 43.52,53.02 v43.5,53 | XG101.7 44.71,53.02 v44.7,53 | XG101.1 45.91,53.02 v45.9,53 | XG101.98 26.72,50.02 v26.7,50 | XG101.74 31.52,51.79 v31.5,51.8 | XG101.66 33.12,51.59 v33.1,51.6 | XG101.60 34.31,51.59 v34.3,51.6 | XG101.52 35.91,51.59 v35.9,51.6 | XG101.42 37.91,51.59 v37.9,51.6 | XG101.32 39.91,51.59 v39.9,51.6 | XG101.22 41.91,51.59 v41.9,51.6 | XG101.14 43.52,51.59 v43.5,51.6 | XG101.8 44.71,51.59 v44.7,51.6 | XG101.2 45.91,51.59 v45.9,51.6
  Top 0.203: CA901.2 61.1,32.05 v61.1,32.77
  Top 0.254: CA309.2 24.75,12.95 v24.8,13 | TA601.5 63.05,50.75 63.65,51.35 63.55,51.35 | TA601.8 64.55,50.75 63.8,51.5 TA601.TH 63.55,51.35 | TA601.3 63.55,51.35 | CA606.2 61.7,53.95 v61.7,53.5 | CA702.2 v53,45.8 | CA701.2 52.95,40.6 v52,40.6 | CA703.2 58.6,43.65 v58.6,44.2 | v57.9,44.2 57.9,43.72 57.73,43.55 TA701.12 57.03,43.55 56.98,43.5 56.1,43.5 v56,43.4 | CA706.2 v60.4,40 | CA705.2 v58,38.8 | CA704.2 v52,38.8
  Bottom 0.2: X1.3 44.1,43.97 v44.1,43.7 | X2.5 v28.5,45.2
  other vias: 57.4,18.8 58.6,18.8 56.2,20 56.2,21.2 55,18.8 53.8,18.8 56.2,17.6 56.2,16.4 55,21.2 53.8,21.2 53.8,20 57.4,21.2 58.6,21.2 58.6,20 58.6,17.6 58.6,16.4 57.4,16.4 55,16.4 53.8,16.4 53.8,17.6 61.5,7.6 62.1,7.6 62.7,7.6 62.7,7.2 62.1,7.2 61.5,7.2 55.6,31.4 55.6,30 55.6,32.8 57,31.4 54.2,31.4 57,32.8 54.2,32.8 54.2,30 57,30 63.8,51.6 64.3,51.6 63.3,51.6 63.8,52.1 63.8,51.1 64.3,52.1 64.3,51.1 63.3,51.1 63.3,52.1 69,49 68.2,49 68.4,48.2 67.8,47.6 68.4,47 67.8,46.4 69.2,46.4 70,46.4 70.8,46.4 71,45.6 70.2,45.6 70,44.8 70.8,44.8 71,44 70.2,44 70,43 70.8,43 71,42 70.2,42 70.6,41.2 69.6,41.2 68.6,41.2 67.6,48.4 49.9,35.7 50.6,35.7 52,35.7 52.7,34.8 52.7,35.7 49.9,34.8 59.5,27.2 60.3,27.2 61.1,27.2 61.1,28 51.3,35.7 55.4,11.7 54.8,11.7 55.1,12.1 58.1,12.1 57,25.3 60.3,24.8 60.3,24.2 49.7,17.7 49.7,17 49.7,16.4 49.7,15.7 50.5,16.7 55.4,42.8 56.6,42.8 56,42.2 56,42.8
  pour GND (no thermals): -1.1,64.5 79.1,64.5 79.1,-6 -1.1,-6
  pour Top (no thermals): 61.8,6.4 61.3,6.9 61.3,7.9 63,7.9 63.1,7.8 63.1,6.9 62.6,6.4
  pour Top (no thermals): 61,49 61.8,49.8 62.7,49.8 62.9,50 63.2,50 63.2,49.9 62.3,49 62.3,48.1 61,48.1
  pour Top (no thermals): 66.6,49 65.8,49.8 64.9,49.8 64.7,50 64.4,50 64.4,49.9 65.3,49 65.3,48.1 66.6,48.1
  pour Top (no thermals): 67.4,49.4 67.4,41 71.2,41 71.2,46.2 71,46.4 71,48.2 70.6,48.6 70,48.6 69.2,49.4
  pour Top (no thermals): 49.6,36 49.6,34.4 53,34.4 53,36
  pour Top (no thermals): 58.6,28.5 61.4,28.5 61.4,26.9 59.4,26.9 58.6,27.7
  cutout Top (no thermals): 7.4,46.2 25.6,46.2 25.6,40.2 28.6,40.2 28.6,25.6 -1.8,25.6 -1.8,43.6 7.4,43.6
  cutout GND (no thermals): 7.4,46.2 25.6,46.2 25.6,40.2 28.6,40.2 28.6,25.6 25.6,25.6 -1.8,25.6 -1.8,43.6 7.4,43.6
  cutout Route15 (no thermals): 7.4,46.2 25.6,46.2 25.6,40.2 28.6,40.2 28.6,25.6 25.6,25.6 -1.8,25.6 -1.8,43.6 7.4,43.6
  cutout Bottom (no thermals): 7.4,46.2 25.6,46.2 25.6,40.4 25.6,40.2 28.6,40.2 28.6,25.6 25.6,25.6 -1.8,25.6 -1.8,43.6 7.4,43.6
  pour Top (no thermals): 54.5,13.3 56.2,13.3 56.2,12.3 55.8,12.3 55.6,12.1 55.6,11.5 54.5,11.5
  pour Top (no thermals): 57.2,13.1 58.5,13.1 58.5,11.7 58.1,11.7 57.6,12.2 57.2,12.2
  pour Top (no thermals): 56.6,24.5 56.6,25.7 57,25.7 57.4,25.3 57.4,24.5
  pour Top (no thermals): 59.1,24.9 60.8,24.9 60.8,24 59.1,24
  pour Top (no thermals): 49.4,18 50.8,18 50.8,16.8 50.4,16.4 50.4,15.4 49.4,15.4
HDMI_CLK_ICE_N
  Top 0.12: KF401.34 57.92,15.19 arc45 58.2,14.51 arc45 58.71,14.3 59.1,14.3 RA302.2 59.84,13.56 arc-45 59.9,13.42 59.9,10.71 arc-45 59.75,10.36 59.45,10.05 arc-45 59.09,9.9 30.71,9.9 arc-45 30.35,10.05 29.95,10.46 arc-45 29.8,10.81 29.8,13.5 arc45 29.66,13.85 arc45 29.52,13.9 28.86,13.9 arc45 28.5,13.76 CA301.1 27.9,13.15 RA301.1
HDMI_CLK_ICE_P
  Top 0.12: CA302.1 29.38,12.97 arc-45 29.53,12.62 29.53,10.7 arc45 29.68,10.35 30.26,9.76 arc45 30.62,9.61 59.18,9.61 arc45 59.54,9.76 60.02,10.25 arc45 60.17,10.6 60.17,13.77 RA302.1 60.4,14.74 arc45 60.25,15.09 59.77,15.57 arc-45 59.63,15.93 KF401.37
HDMI_CLK_N
  Top 0.12: XG101.190 28.31,16.28 arc45 28.32,16.27 arc-45 28.38,16.13 28.38,15.71 arc-45 28.23,15.36 28.15,15.27 arc45 28,14.92 CA301.2
HDMI_CLK_P
  Top 0.12: XG101.188 28.72,16.27 arc45 28.65,16.12 28.65,15.71 arc45 28.8,15.36 28.95,15.2 arc-45 29.1,14.85 CA302.2
HDMI_SCL  (via drill 0.2)
  Top 0.1: XG101.200 26.31,15.92 25.8,15.4 25.8,10.44 27.34,8.9 59.9,8.9 61.2,10.2 61.2,15.03 61.6,15.43 61.6,17.7 v61.2,18.1 | v60.4,20.6 KF401.46
  Bottom 0.1: v61.2,18.1 61,18.3 61,18.69 60.85,18.84 60.85,19.07 60.4,19.52 v60.4,20.6
HDMI_SDA  (via drill 0.2)
  Top 0.1: XG101.199 26.31,19.34 25.5,18.53 25.5,10.3 27.2,8.6 60.08,8.6 61.5,10.02 61.5,14.77 62,15.27 62,18.4 61.4,19 v61.2,19 | v60.9,21.6 60.41,21.12 KF401.47
  Bottom 0.1: v61.2,19 60.8,19.4 60.8,21.5 v60.9,21.6
HDMI_TX0_ICE_N
  Top 0.12: KF401.31 56.42,15.08 56.43,15.07 arc-45 56.58,14.72 56.58,12.01 arc-45 56.4,11.58 56.4,11.5 RA304.2 56.3,11.3 56.45,11.15 56.45,11.15 arc-45 55.85,10.9 37.73,10.9 arc-45 37.13,11.15 34.93,13.36 arc45 34.58,13.5 32.8,13.5 arc45 32.46,13.36 arc45 32.4,13.22 32.4,12.44 arc45 32.46,12.3 CA303.1 33.9,11.7 RA303.1
HDMI_TX0_ICE_P
  Top 0.12: CA304.1 33.39,13.15 arc-45 33.53,13.2 34.49,13.2 arc-45 34.85,13.06 37.02,10.88 arc45 37.62,10.63 56.42,10.63 arc45 56.78,10.78 57.2,11.2 RA304.1 57.2,11.39 57.05,11.55 arc-45 56.85,12.03 56.85,14.6 56.85,14.61 56.85,14.82 arc-45 56.92,14.99 KF401.32
HDMI_TX0_N
  Top 0.12: XG101.184 29.52,16.27 29.58,16.21 29.58,15.94 30.75,14.77 arc-45 30.9,14.42 30.9,12.63 arc45 30.96,12.49 31.34,12.1 31.35,12.1 CA303.2
HDMI_TX0_P
  Top 0.12: XG101.182 29.91,16.27 29.85,16.21 29.85,16.05 31.02,14.88 arc-45 31.17,14.53 31.17,13.09 arc45 31.23,12.95 31.31,12.86 arc45 31.45,12.8 CA304.2
HDMI_TX1_ICE_N
  Top 0.12: CA305.1 39.05,13 39.6,13 | 39.6,13 40.19,13 arc-45 40.55,12.86 41.57,11.83 arc45 41.93,11.68 52.21,11.68 arc45 52.57,11.83 52.57,11.84 arc45 52.72,12.19 52.72,13.04 arc-45 52.78,13.18 RA306.2 53.7,14.2 54.28,14.78 arc45 54.42,15.14 KF401.27 | RA305.1 39.7,12.9 39.6,13
HDMI_TX1_ICE_P
  Top 0.12: CA306.1 39.09,13.46 arc45 39.23,13.4 40.1,13.4 arc-45 40.46,13.26 41.66,12.05 arc45 42.02,11.9 52.09,11.9 arc45 52.45,12.05 arc45 52.5,12.18 52.5,13.8 52.7,14 RA306.1 53.2,14.6 arc-45 53.58,14.76 arc90 53.92,15.1 KF401.26
HDMI_TX1_N
  Top 0.12: XG101.178 30.72,16.48 arc45 30.86,16.13 32.51,14.48 arc45 32.86,14.33 35.36,14.33 arc-45 35.72,14.19 36.8,13.1 37.15,13.1 37.45,12.8 CA305.2
HDMI_TX1_P
  Top 0.12: XG101.176 31.12,16.48 arc45 31.26,16.13 32.64,14.75 arc45 32.99,14.6 35.48,14.6 arc-45 35.83,14.46 36.88,13.4 37.25,13.4 37.45,13.6 CA306.2
HDMI_TX2_ICE_N
  Top 0.12: CA307.1 44.55,14.1 45.2,14.1 | 45.2,14.1 46.59,14.1 arc-45 46.95,13.96 48.07,12.83 arc45 48.43,12.68 50.71,12.68 arc45 50.85,12.74 50.96,12.85 arc45 51.02,13 51.02,13.62 arc-45 51.17,13.97 RA308.2 51.74,14.55 arc-45 51.88,14.6 arc45 52.08,14.69 52.33,14.93 arc-45 53.38,15.37 KF401.25 | RA307.1 45.2,14.1
HDMI_TX2_ICE_P
  Top 0.12: CA308.1 44.59,14.56 arc45 44.73,14.5 46.5,14.5 arc-45 46.86,14.36 48.16,13.05 arc45 48.52,12.9 50.62,12.9 arc45 50.76,12.96 arc45 50.8,13.06 50.8,13.6 arc45 50.65,13.95 RA308.1 50.61,14.42 arc45 50.9,15.11 50.9,16.1 arc-45 51.05,16.47 arc-45 51.42,16.62 KF401.23
HDMI_TX2_N
  Top 0.12: XG101.172 31.91,16.48 arc45 32.06,16.13 32.81,15.38 arc45 33.16,15.23 40.86,15.23 arc-45 41.22,15.09 41.95,14.35 arc45 42.31,14.2 42.75,14.2 42.95,14 CA307.2
HDMI_TX2_P
  Top 0.12: XG101.170 32.31,16.48 arc45 32.46,16.13 32.94,15.65 arc45 33.29,15.5 40.98,15.5 arc-45 41.33,15.36 42.04,14.64 arc45 42.4,14.5 42.74,14.5 42.95,14.7 CA308.2
ICE_CDONE  (via drill 0.2)
  Top 0.1: KF401.7 55.92,22.68 55.45,23.15 55.45,23.7 55.5,23.75 55.5,24.4 55.6,24.5 55.6,26 52.8,28.8 v50.11,28.8 v50.1,28.79 | v45.6,48.7 45,48.1 45,47.4 45.3,47.1 45.3,37.5 47.4,35.4 47.4,33.8 v47.2,33.6
  Bottom 0.1: v50.1,28.79 48.7,28.79 47.2,30.29 v47.2,33.6 | X1.7 43.2,46.81 43.2,48.2 43.4,48.4 43.6,48.4 44.09,48.9 45.4,48.9 v45.6,48.7
ICE_CRESET_B  (via drill 0.2)
  Top 0.1: KF401.8 55.42,22.9 55.25,23.07 55.25,24.55 55.4,24.7 55.4,25.6 52.6,28.4 v48.8,28.4 | v44.4,48.4 44.6,48.2 44.6,47.3 44.9,47 44.9,35.1 v46.4,33.6
  Bottom 0.1: v48.8,28.4 48.2,28.4 46.4,30.2 v46.4,33.6 | X1.9 44.77,48.03 v44.4,48.4
ICE_SCK  (via drill 0.2)
  Top 0.1: 52.52,20.62 KF401.15 51.59,20.62 51,21.2 51,25.4 51.8,26.2 51.8,27.2 51.4,27.6 v48.1,27.6 | v44,32.6 42.2,32.6 41.7,33.1 41.7,34.1 43.6,36 v43.6,41.8
  Bottom 0.1: v48.1,27.6 44,31.7 v44,32.6 | X1.4 43.6,43.2 v43.6,41.8
ICE_SI  (via drill 0.2)
  Top 0.1: KF401.17 52.5,19.62 51.96,20.16 51.24,20.16 50.4,21 50.4,25.4 51,26 51,27 50.8,27.2 50,27.2 49.4,26.6 v48.2,26.6 | v42.2,33.6 42.2,34 44.2,36 44.2,42.8 43.6,43.4 v43.6,47.8
  Bottom 0.1: v48.2,26.6 47.8,26.6 42.2,32.2 v42.2,33.6 | X1.8 43.5,47.7 v43.6,47.8
ICE_SO  (via drill 0.2)
  Top 0.1: 52.49,21.12 KF401.14 51.49,21.12 51.2,21.4 51.2,25.2 52.1,26.1 52.1,27.3 51.4,28 v49.4,28 | v44.8,33.6 44.8,34.4 44.6,34.6 44.6,46.8 44.1,47.3 44.1,48.1 v43.4,48.8
  Bottom 0.1: v49.4,28 48.2,28 44.8,31.4 v44.8,33.6 | v43.4,48.8 42.8,49.4 40.2,49.4 39.8,49 39.8,47.4 40.96,46.24 X1.6
ICE_SS  (via drill 0.2)
  Top 0.1: 52.52,20.12 KF401.16 52.29,20.12 51.99,20.42 51.5,20.42 50.8,21.12 50.8,25.49 51.3,25.99 51.3,27.1 51,27.4 48.9,27.4 v48.7,27.2 | v43.2,33.6 43.8,33 47.8,33 48,33.2 48,35.8 45.6,38.2 45.6,47.6 v45.4,47.8
  Bottom 0.1: v48.7,27.2 48.5,27 47.9,27 43.2,31.7 v43.2,33.6 | X1.10 45.4,46.48 v45.4,47.8
ICE_VCC  (via drill 0.2, 0.35)
  Top 0.1: TA701.1 54.56,44.69 v54.45,44.8 | v57.9,41 57.87,40.97 56.75,40.97 TA701.8
  Top 0.254: RA401.2 53.6,11.8 v53.2,11.8 | v56.4,23.3 56.41,23.32 CA404.1 | TA701.8 56.75,40.37 57.12,40 CA706.1 58.95,38.8 58.95,38.4 65.6,31.75 65.6,24.4 64.8,23.6 v61.17,23.6 | BIAS-1.8V.1 18.4,20.24 17.84,20.8 v17.4,20.8
  Route15 0.254: v17.4,20.8 18.2,20 24.4,20 26,18.4 45.05,18.4
  Bottom 0.1: v54.45,44.8 54.45,42.55 55,42 55,41 v57.9,41
  other vias: 56.1,14.7
  pour Top (no thermals): 55.5,13.5 55.5,14.4 55.8,14.7 55.8,15.8 56,15.8 56,14.9 56.2,14.7 56.2,13.5
  pour Top (no thermals): 56.8,22 56.8,22.8 56.6,23 56.6,23.6 57.3,23.6 57.3,22.9 57.1,22.7 57,22.6 57,22
  pour Route15 (no thermals): 43.6,26.2 43.6,8.8 68.2,8.8 68.2,26.2
ICE_VCCIO  (via drill 0.2, 0.35)
  Top 0.1: TA701.16 55.25,45.15 v55.2,45.2 | v54.7,40.8 55.25,40.8 TA701.5 | 49.94,41.56 50,41.5 | 50,41.5 50,41.82 | 50,41.5 50,41.84
  Top 0.254: CA406.1 51.26,17.1 v51.2,17.1 | TA701.5 55.25,40 CA704.1 | CA704.1 v54.8,38.8 | v48.6,25.2 v48.6,21.2 | CA704.1 53.25,39.6 51.8,39.6 51.4,40 51.4,41.64 51.2,41.84 50,41.84 49.98,41.82 | JP1.1 50,41.5 50,41.82 49.32,41.82 48.82,41.33 v48.82,40.4
  Bottom 0.1: v55.2,45.2 54.2,45.2 54,45 54,42.4 54.6,41.8 54.6,40.9 v54.7,40.8
  Bottom 0.254: v54.8,38.8 53.2,37.21 53.2,34.11 51.2,32.1 51.2,29 48.6,26.4 v48.6,25.2 | v48.82,40.4 46.8,40.4 45.6,41.6 45.6,44.13 X1.1
  other vias: 57.6,14.7 60,22.3 59.4,22.3 60,22.9
  pour Top (no thermals): 57.2,13.8 57.2,14.6 57.3,14.7 57.3,15.8 57.5,15.8 57.5,14.9 57.9,14.5 57.9,13.8
  pour Top (no thermals): 58.8,22.4 59.3,22.9 59.3,23.6 60.4,23.6 60.4,22.1 59.2,22.1 59,21.9 58.8,21.9
  pour Top (no thermals): 53.1,17.2 52.5,17.2 51.9,17.8 51.4,17.8 51.4,17.2 52,17.2 52.2,17 53.1,17
  pour Bottom (no thermals): 45.8,14.4 61.2,14.4 61.2,26.2 45.8,26.2
ICE_VPP_2V5  (via drill 0.2, 0.35)
  Top 0.254: TA701.6 55.75,39 CA705.1 54.95,37.8 50,37.8 v49.8,37.6 | BIAS-2.5V.1 20.4,19.8 21.4,20.8 v21.8,20.8
  Route15 0.254: v49.8,37.6 47,37.6 45.6,36.2 45.6,21.4 | 45.6,21.4 45.6,15.8 46.6,14.8 51.35,14.8 v52.2,15.65 | v21.8,20.8 42.6,20.8 43.2,21.4 45.6,21.4
  pour Top (no thermals): 51.5,16.1 52.1,16.1 52.2,16.2 53.1,16.2 53.1,16 52.7,16 52.1,15.4 51.5,15.4
LT8336_BST
  Top 0.254: CA607.2 66.05,52.85 65.55,52.35 TA601.12
N$2
  Top 0.1: XG101.153 35.52,21.39 RA101.2
N$3
  Top 0.1: CA608.2 58.95,47.6 RA601.1 RA602.2 59.9,48.7 60.6,49.4 60.6,49.8 61.65,50.85 TA601.4
N$4
  pour Top (no thermals): 64.9,51.9 65.7,51.9 66,52.2 67,52.2 67.3,52.5 67.3,53 67.9,53.6 68,53.6 68,50 66.9,50 66.2,50.7 65.7,50.7 65.6,50.8 64.9,50.8
N$5
  Top 0.1: TA601.2 61.85,51.85 61.2,51.2 RA603.2
N$6
  Top 0.1: RA604.1 60.7,52.4 | 60.7,52.4 RA605.2 | TA601.1 60.75,52.35 60.7,52.4
N$7
  Top 0.1: RA801.1 5.65,47.5 KF801.3 5.6,48 4.95,48.65 QA801.1 QA802.1
N$8
  Top 0.1: CA606.1 63.45,54.95 63.2,55.2 61.1,55.2 60.7,54.8 RA604.2
  Top 0.254: TA601.15 63.55,54.3 CA606.1
N$9
  Top 0.1: TA701.15 55.75,45.85 RA701.2
N$10
  Top 0.1: ENABLE_SEL.2 52.8,48.8 54.9,46.7 RA701.1
N$11
  Top 0.254: BIAS-2.5V.2 RA309.1 18.9,15.7 18.4,16.2 BIAS-1.8V.2
N$12
  Top 0.1: PF_PI_ACTIVITY.A RA102.1
N$14
  Top 0.1: KF1001.3 70.4,36.4 71.25,35.55 KF1002.1 73.7,35.6 RA1001.1
N$15  (via drill 0.2)
  Top 0.1: RA1002.2 63,37.2 v63.2,37.4 | v72.1,37.9 72.1,36.35 KF1002.3
  Bottom 0.1: v63.2,37.4 63.2,37.8 65.2,39.8 69.2,39.8 71.1,37.9 v72.1,37.9
RUN_PG  (via drill 0.2)
  Top 0.1: RUN_PG.TP v15.2,54 | v27.9,51.6 27.91,51.59 XG101.92
  Bottom 0.1: v15.2,54 17.6,51.6 v27.9,51.6
STM_SWCLK  (via drill 0.2)
  Top 0.1: KF901.24 52.45,29.65 52.2,29.4 v49.6,29.4 | v31.4,46.8 32.2,46 34,46 38.2,41.8 38.2,38.2 v38.8,37.6
  Bottom 0.1: v49.6,29.4 49.2,29.4 48,30.6 48,34 44.4,37.6 v38.8,37.6 | X2.4 31.37,46.8 v31.4,46.8
STM_SWDIO  (via drill 0.2)
  Top 0.1: KF901.23 52.35,30.15 52,29.8 v50.4,29.8 | v34.6,46.2 39.2,41.6 v39.2,39.2
  Bottom 0.1: v50.4,29.8 50,29.8 48.8,31 48.8,34.2 44.6,38.4 40,38.4 v39.2,39.2 | X2.2 32.04,46.2 v34.6,46.2
USB_N
  Top 0.12: XG101.103 45.52,19.55 45.51,19.55 arc45 45.45,19.41 45.45,19.04 arc45 45.51,18.9 45.54,18.86 arc45 45.68,18.8 46.62,18.8 arc45 46.76,18.86 47.14,19.25 arc45 47.2,19.39 47.2,28 arc-45 47.49,28.71 49.46,30.68 arc-45 50.17,30.97 52.5,30.97 52.68,31.15 KF901.21
USB_P
  Top 0.12: XG101.105 45.12,19.55 45.12,19.55 arc-45 45.18,19.41 45.18,18.93 arc45 45.24,18.78 45.41,18.61 | 45.41,18.61 | 45.41,18.61 45.43,18.59 arc45 45.57,18.53 46.73,18.53 arc45 46.87,18.59 46.89,18.61 | 46.89,18.61 | 46.89,18.61 47.41,19.13 arc45 47.47,19.28 47.47,27.89 arc-45 47.76,28.6 49.58,30.41 arc-45 50.28,30.7 52.5,30.7 52.55,30.65 KF901.22
VCCPLL
  Top 0.254: RA401.1 53.9,13 54.78,13.89 CA401.1
  pour Top (no thermals): 54.5,14.4 54.8,14.4 55.3,14.9 55.3,15.8 55.5,15.8 55.5,14.7 55.3,14.5 55.3,13.5 54.5,13.5

## Text on the board
tNames: ------------------------------ / GBARPi-CM4 / 2020 12 / ------------------------------ / Use 3.6 V nom. / 4.2 V max. / 18650 Li-Ion Cell / with 3 A current capability / ------------------------------ / Component Reference Designators / according to IEC 81346-2